# Altium schematic sheet altium.schdoc
size 298 x 217 mm
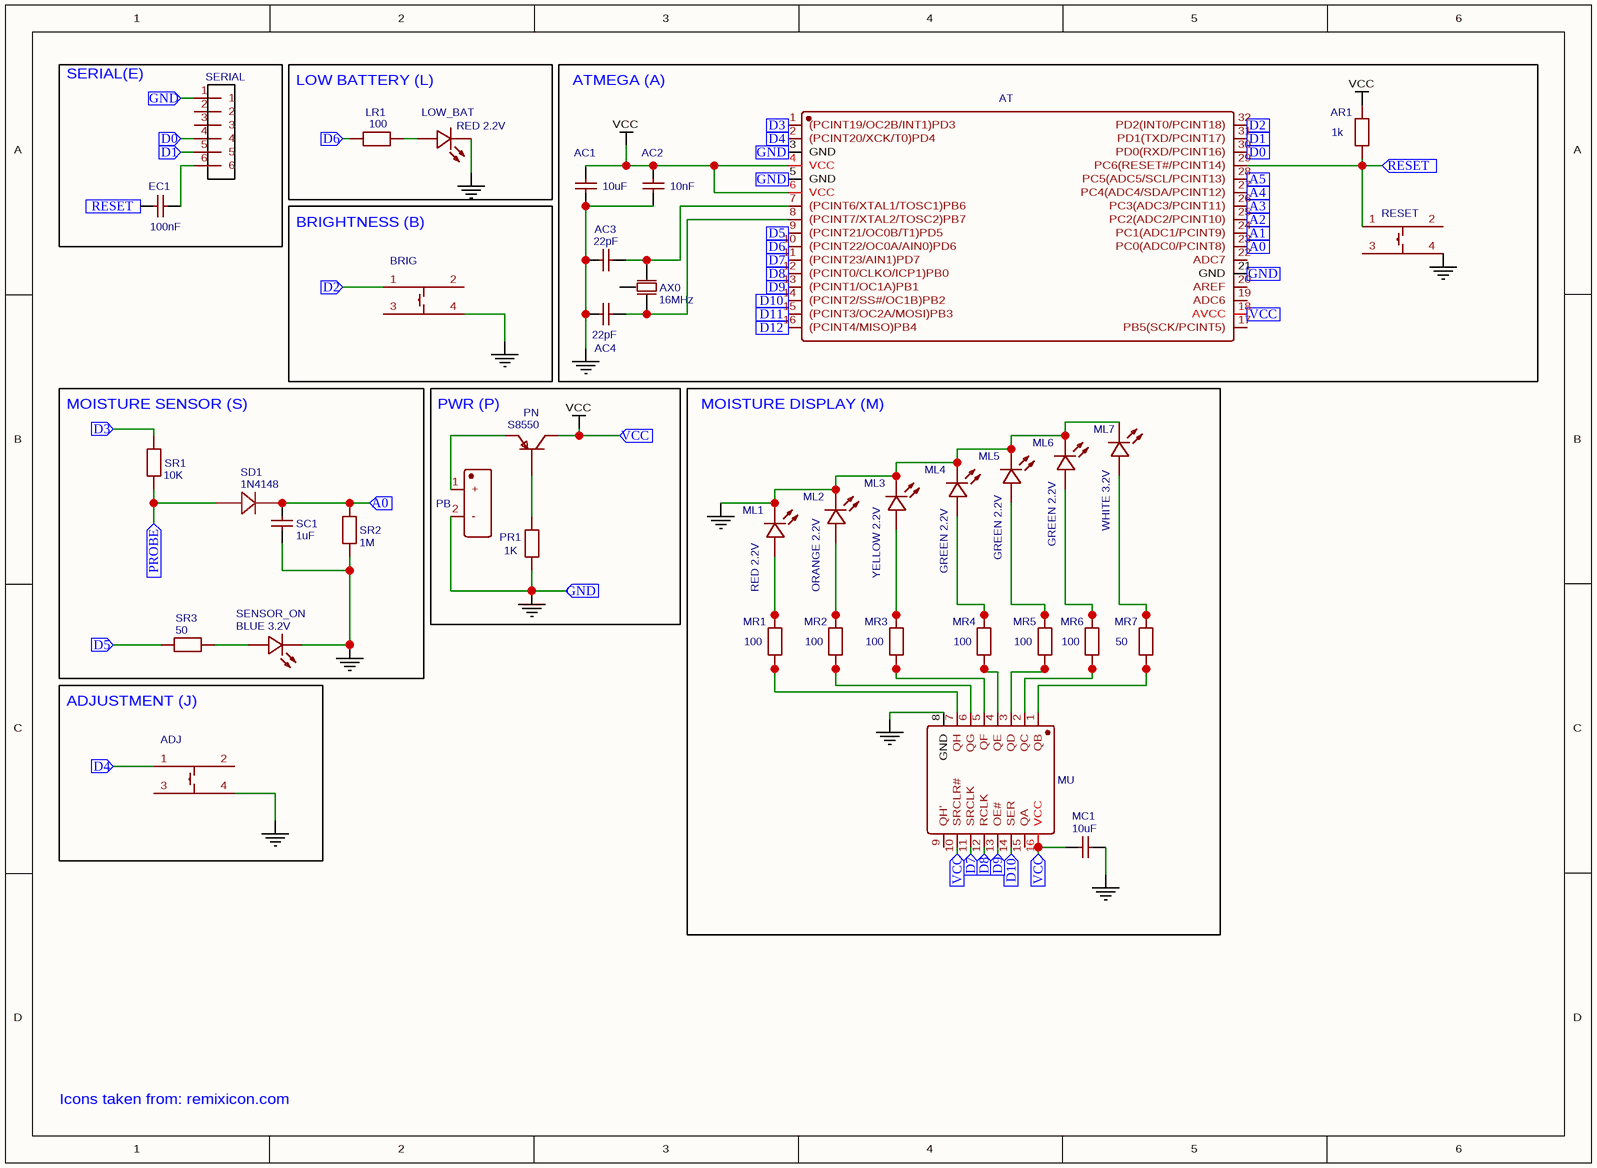
[diagram p0: altium.schdoc]

## Parts
AC1  10uF  [C0805]
AC2  10nF  [C0805]
AC3  22pF  [C0805]
AC4  22pF  [C0805]
ADJ  Push Button  [PUSH_BUTTON-SMD_4P]  (value not drawn)
AR1  1k  [R0805]
AT  ATMEGA328P-AU  [TQFP-32_L7.0-W7.0-P0.80-LS9.0-BL]  (value not drawn)
AX0  16MHz  [OSC-SMD_3P-L3.2-W1.3-P1.2-L]
BRIG  Push Button  [PUSH_BUTTON-SMD_4P]  (value not drawn)
EC1  100nF  [C0805]
LOW_BAT  RED 2.2V  [LED0603-RD]
LR1  100  [R0805]
MC1  10uF  [C0805]
ML1  RED 2.2V  [LED0603-RD]
ML2  ORANGE 2.2V  [LED0603-RD]
ML3  YELLOW 2.2V  [LED0603-RD]
ML4  GREEN 2.2V  [LED0603-RD]
ML5  GREEN 2.2V  [LED0603-RD]
ML6  GREEN 2.2V  [LED0603-RD]
ML7  WHITE 3.2V  [LED0603-RD]
MR1  100  [R0805]
MR2  100  [R0805]
MR3  100  [R0805]
MR4  100  [R0805]
MR5  100  [R0805]
MR6  100  [R0805]
MR7  50  [R0805]
MU  CD74HC595M96  [SOIC-16_L10.8-W4.5-P1.27-LS6.8-BL]  (value not drawn)
PB  ‎BK-18650-PC2‎  [18650_BAT_MM]  (value not drawn)
PN  S8550  [SOT-23-3_L2.9-W1.3-P1.90-LS2.4-BR]
PR1  1K  [R0805]
RESET  Push Button  [PUSH_BUTTON-SMD_4P]  (value not drawn)
SC1  1uF  [C0805]
SD1  1N4148  [SOD-123FL_L2.6-W1.6-LS3.4-R-FD]
SENSOR_ON  BLUE 3.2V  [LED0603-RD]
SERIAL  SERIAL  [2.54 6PIN]
SR1  10K  [R0805]
SR2  1M  [R0805]
SR3  50  [R0805]

## Blocks framed on the sheet
SERIAL(E): EC1 SERIAL
LOW BATTERY (L): LOW_BAT LR1
ATMEGA (A): AC1-AC4 AR1 AT AX0 RESET
BRIGHTNESS (B): BRIG
MOISTURE SENSOR (S): SC1 SD1 SENSOR_ON SR1-SR3
PWR (P): PB PN PR1
MOISTURE DISPLAY (M): MC1 ML1-ML7 MR1-MR7 MU
ADJUSTMENT (J): ADJ

## Ports
A0 (in), A1 (in), A2 (in), A3 (in), A4 (in), A5 (in), D0 (in), D1 (in), D2 (in), D3 (in), D4 (in), D5 (in), D6 (in), D7 (in), D8 (in), D9 (in), D10 (in), D11 (in), D12 (in), GND (in), PROBE (in), RESET (in), VCC (in)

## Nets
GND: AC1.2 AC2.2 AC3.1 AC4.1 ADJ.4 AT.3(GND) AT.5(GND) AT.21(GND) BRIG.4 LOW_BAT.1(K) MC1.2 ML1.1(K) ML2.1(K) ML3.1(K) ML4.1(K) ML5.1(K) ML6.1(K) ML7.1(K) MU.8(GND) PB.2(-) PR1.1 RESET.4 SC1.2 SENSOR_ON.1(K) SERIAL.1 SR2.2 ; port GND
VCC: AC1.1 AC2.1 AR1.2 AT.4(VCC) AT.6(VCC) AT.18(AVCC) MC1.1 MU.10(SRCLR#) MU.16(VCC) PN.3(C) ; port VCC
A0: AT.23(PC0(ADC0/PCINT8)) SC1.1 SD1.1(C) SR2.1 ; port A0
A1: AT.24(PC1(ADC1/PCINT9)) ; port A1
A2: AT.25(PC2(ADC2/PCINT10)) ; port A2
A3: AT.26(PC3(ADC3/PCINT11)) ; port A3
A4: AT.27(PC4(ADC4/SDA/PCINT12)) ; port A4
A5: AT.28(PC5(ADC5/SCL/PCINT13)) ; port A5
D0: AT.30(PD0(RXD/PCINT16)) SERIAL.4 ; port D0
D1: AT.31(PD1(TXD/PCINT17)) SERIAL.5 ; port D1
D2: AT.32(PD2(INT0/PCINT18)) BRIG.1 ; port D2
D3: AT.1((PCINT19/OC2B/INT1)PD3) SR1.2 ; port D3
D4: ADJ.1 AT.2((PCINT20/XCK/T0)PD4) ; port D4
D5: AT.9((PCINT21/OC0B/T1)PD5) SR3.2 ; port D5
D6: AT.10((PCINT22/OC0A/AIN0)PD6) LR1.1 ; port D6
D7: AT.11((PCINT23/AIN1)PD7) MU.11(SRCLK) ; port D7
D8: AT.12((PCINT0/CLKO/ICP1)PB0) MU.12(RCLK) ; port D8
D9: AT.13((PCINT1/OC1A)PB1) MU.13(OE#) ; port D9
D10: AT.14((PCINT2/SS#/OC1B)PB2) MU.14(SER) ; port D10
D11: AT.15((PCINT3/OC2A/MOSI)PB3) ; port D11
D12: AT.16((PCINT4/MISO)PB4) ; port D12
PROBE: SD1.2(A) SR1.1 ; port PROBE
RESET: AR1.1 AT.29(PC6(RESET#/PCINT14)) EC1.2 RESET.1 ; port RESET
NetAC3_2: AC3.2 AT.7((PCINT6/XTAL1/TOSC1)PB6) AX0.3(OSC2)
NetAC4_2: AC4.2 AT.8((PCINT7/XTAL2/TOSC2)PB7) AX0.1(OSC1)
NetEC1_1: EC1.1 SERIAL.6
NetLOW_BAT_2: LOW_BAT.2(A) LR1.2
NetML1_2: ML1.2(A) MR1.2
NetML2_2: ML2.2(A) MR2.2
NetML3_2: ML3.2(A) MR3.2
NetML4_2: ML4.2(A) MR4.2
NetML5_2: ML5.2(A) MR5.2
NetML6_2: ML6.2(A) MR6.2
NetML7_2: ML7.2(A) MR7.2
NetMR1_1: MR1.1 MU.7(QH)
NetMR2_1: MR2.1 MU.6(QG)
NetMR3_1: MR3.1 MU.5(QF)
NetMR4_1: MR4.1 MU.4(QE)
NetMR5_1: MR5.1 MU.3(QD)
NetMR6_1: MR6.1 MU.2(QC)
NetMR7_1: MR7.1 MU.1(QB)
NetPB_1: PB.1(+) PN.2(E)
NetPN_1: PN.1(B) PR1.2
NetSENSOR_ON_2: SENSOR_ON.2(A) SR3.1

Not connected (* = marked no-connect by the designer): ADJ 2 3; AT 17(PB5(SCK/PCINT5)) 19(ADC6) 20(AREF) 22(ADC7); AX0 2(GND); BRIG 2 3; MU 9(QH’) 15(QA); RESET 2 3; SERIAL 2 3

## Notes on the sheet
- Icons taken from: remixicon.com

## Library data of the parts
AC1 MC1 = 10uF: Manufacturer: YAGEO; Manufacturer Part: CC0805KKX7R9BB105; nameAlias: Capacitance; Supplier: LCSC; Supplier Part: C91185; JLCPCB Part Class: Extended Part; spicePre: C; spiceSymbolName: CC0805KKX7R9BB105
AC2 = 10nF: Manufacturer: YAGEO; Manufacturer Part: CC0805KKX7R9BB105; nameAlias: Capacitance; Supplier: LCSC; Supplier Part: C91185; JLCPCB Part Class: Extended Part; spicePre: C; spiceSymbolName: CC0805KKX7R9BB105
AC3 AC4 = 22pF: Manufacturer: YAGEO; Manufacturer Part: CC0805KKX7R9BB105; nameAlias: Capacitance; Supplier: LCSC; Supplier Part: C91185; JLCPCB Part Class: Extended Part; spicePre: C; spiceSymbolName: CC0805KKX7R9BB105
ADJ BRIG RESET = Push Button: Contributor: Smart; Supplier: Office; spicePre: S; spiceSymbolName: Push Button
AR1 = 1k: Manufacturer: Walsin Tech Corp; Manufacturer Part: WR08X102 JTL; nameAlias: Resistance (Ohms); Contributor: LCSC; Package Display: No; Supplier: LCSC; Supplier Part: C384174; spicePre: R; spiceSymbolName: WR08X102 JTL
AT = ATMEGA328P-AU: Manufacturer: MICROCHIP; Supplier: LCSC; Manufacturer Part: ATMEGA328P-AU; Supplier Part: C14877; JLCPCB Part Class: Basic Part; spicePre: U; spiceSymbolName: ATMEGA328P-AU
AX0 = 16MHz: Manufacturer: Murata Electronics; Manufacturer Part: CSTNE16M0V530000R0; nameAlias: Frequency; Contributor: LCSC; Supplier: LCSC; Supplier Part: C341521; JLCPCB Part Class: Extended Part; spicePre: X; spiceSymbolName: CSTNE16M0V530000R0
EC1 = 100nF: Manufacturer: YAGEO; Manufacturer Part: CC0805KKX7R9BB105; nameAlias: Capacitance; Supplier: LCSC; Supplier Part: C91185; JLCPCB Part Class: Extended Part; spicePre: C; spiceSymbolName: CC0805KKX7R9BB105
LOW_BAT ML1 = RED 2.2V: Manufacturer: NATIONSTAR; Manufacturer Part: FC-1608YOXK-600H08; Contributor: LCSC; Supplier: LCSC; Supplier Part: C108553; JLCPCB Part Class: Extended Part; spicePre: L; spiceSymbolName: FC-1608YOXK-600H08
LR1 MR1-MR6 = 100: Manufacturer: Walsin Tech Corp; Manufacturer Part: WR08X102 JTL; nameAlias: Resistance (Ohms); Contributor: LCSC; Package Display: No; Supplier: LCSC; Supplier Part: C384174; spicePre: R; spiceSymbolName: WR08X102 JTL
ML2 = ORANGE 2.2V: Manufacturer: NATIONSTAR; Manufacturer Part: FC-1608YOXK-600H08; Contributor: LCSC; Supplier: LCSC; Supplier Part: C108553; JLCPCB Part Class: Extended Part; spicePre: L; spiceSymbolName: FC-1608YOXK-600H08
ML3 = YELLOW 2.2V: Manufacturer: NATIONSTAR; Manufacturer Part: FC-1608YOXK-600H08; Contributor: LCSC; Supplier: LCSC; Supplier Part: C108553; JLCPCB Part Class: Extended Part; spicePre: L; spiceSymbolName: FC-1608YOXK-600H08
ML4-ML6 = GREEN 2.2V: Manufacturer: NATIONSTAR; Manufacturer Part: FC-1608YOXK-600H08; Contributor: LCSC; Supplier: LCSC; Supplier Part: C108553; JLCPCB Part Class: Extended Part; spicePre: L; spiceSymbolName: FC-1608YOXK-600H08
ML7 = WHITE 3.2V: Manufacturer: NATIONSTAR; Manufacturer Part: FC-1608YOXK-600H08; Contributor: LCSC; Supplier: LCSC; Supplier Part: C108553; JLCPCB Part Class: Extended Part; spicePre: L; spiceSymbolName: FC-1608YOXK-600H08
MR7 SR3 = 50: Manufacturer: Walsin Tech Corp; Manufacturer Part: WR08X102 JTL; nameAlias: Resistance (Ohms); Contributor: LCSC; Package Display: No; Supplier: LCSC; Supplier Part: C384174; spicePre: R; spiceSymbolName: WR08X102 JTL
MU = CD74HC595M96: Manufacturer: TI; Supplier: LCSC; Manufacturer Part: CD74HC595M96; Supplier Part: C131977; JLCPCB Part Class: Extended Part; spicePre: U; spiceSymbolName: CD74HC595M96
PB = ‎BK-18650-PC2‎: Manufacturer: MPD (Memory Protection Devices); Contributor: crojasq; Package Display: No; Manufacturer Part: BK-18650-PC2; Supplier: Digi-Key; Supplier Part: BK-18650-PC2-ND; spicePre: B; spiceSymbolName: ‎BK-18650-PC2‎
PN = S8550: Manufacturer: CBI(创基); Contributor: LCSC; Supplier: LCSC; Supplier Part: C2828467; Manufacturer Part: S8550; spicePre: Q; spiceSymbolName: S8550_C2828467
PR1 = 1K: Manufacturer: Walsin Tech Corp; Manufacturer Part: WR08X102 JTL; nameAlias: Resistance (Ohms); Contributor: LCSC; Package Display: No; Supplier: LCSC; Supplier Part: C384174; spicePre: R; spiceSymbolName: WR08X102 JTL
SC1 = 1uF: Manufacturer: YAGEO; Manufacturer Part: CC0805KKX7R9BB105; nameAlias: Capacitance; Supplier: LCSC; Supplier Part: C91185; JLCPCB Part Class: Extended Part; spicePre: C; spiceSymbolName: CC0805KKX7R9BB105
SD1 = 1N4148: Manufacturer: Tak Cheong; Manufacturer Part: 1N4148W; Contributor: LCSC; Supplier: LCSC; Supplier Part: C129216; JLCPCB Part Class: Extended Part; spicePre: D; spiceSymbolName: 1N4148W-C129216
SENSOR_ON = BLUE 3.2V: Manufacturer: NATIONSTAR; Manufacturer Part: FC-1608YOXK-600H08; Contributor: LCSC; Supplier: LCSC; Supplier Part: C108553; JLCPCB Part Class: Extended Part; spicePre: L; spiceSymbolName: FC-1608YOXK-600H08
SERIAL = SERIAL: Contributor: fifi1231231; spicePre: U; spiceSymbolName: 2.54_6PIN
SR1 = 10K: Manufacturer: Walsin Tech Corp; Manufacturer Part: WR08X102 JTL; nameAlias: Resistance (Ohms); Contributor: LCSC; Package Display: No; Supplier: LCSC; Supplier Part: C384174; spicePre: R; spiceSymbolName: WR08X102 JTL
SR2 = 1M: Manufacturer: Walsin Tech Corp; Manufacturer Part: WR08X102 JTL; nameAlias: Resistance (Ohms); Contributor: LCSC; Package Display: No; Supplier: LCSC; Supplier Part: C384174; spicePre: R; spiceSymbolName: WR08X102 JTL